# Altium schematic sheet STM32H745.SchDoc
size C; SheetNumber: 2; SheetTotal: 14
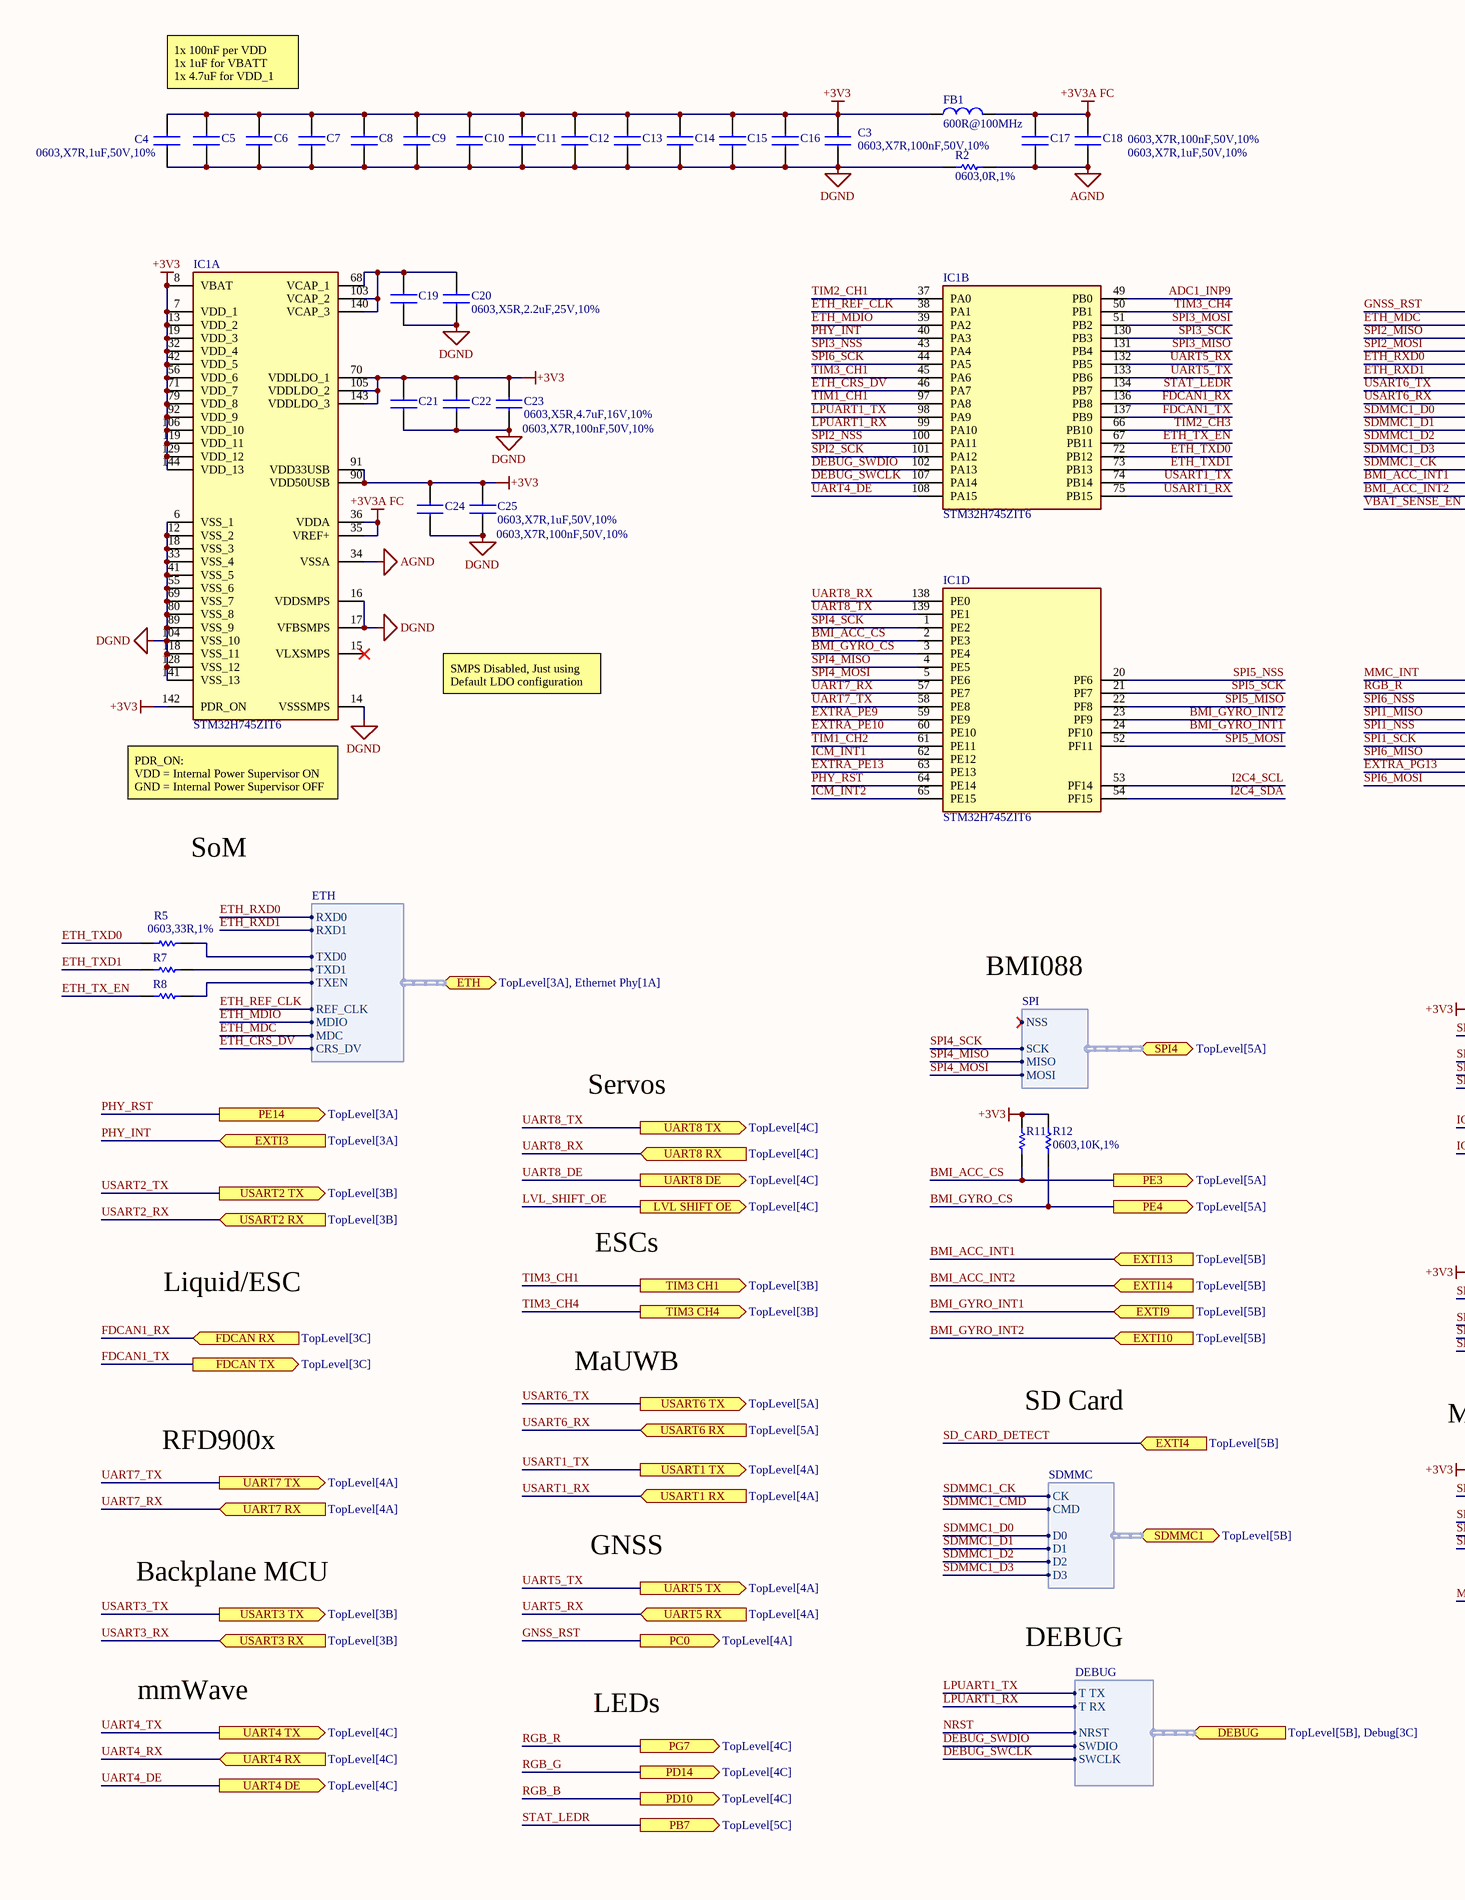
[diagram p0: STM32H745.SchDoc, left]
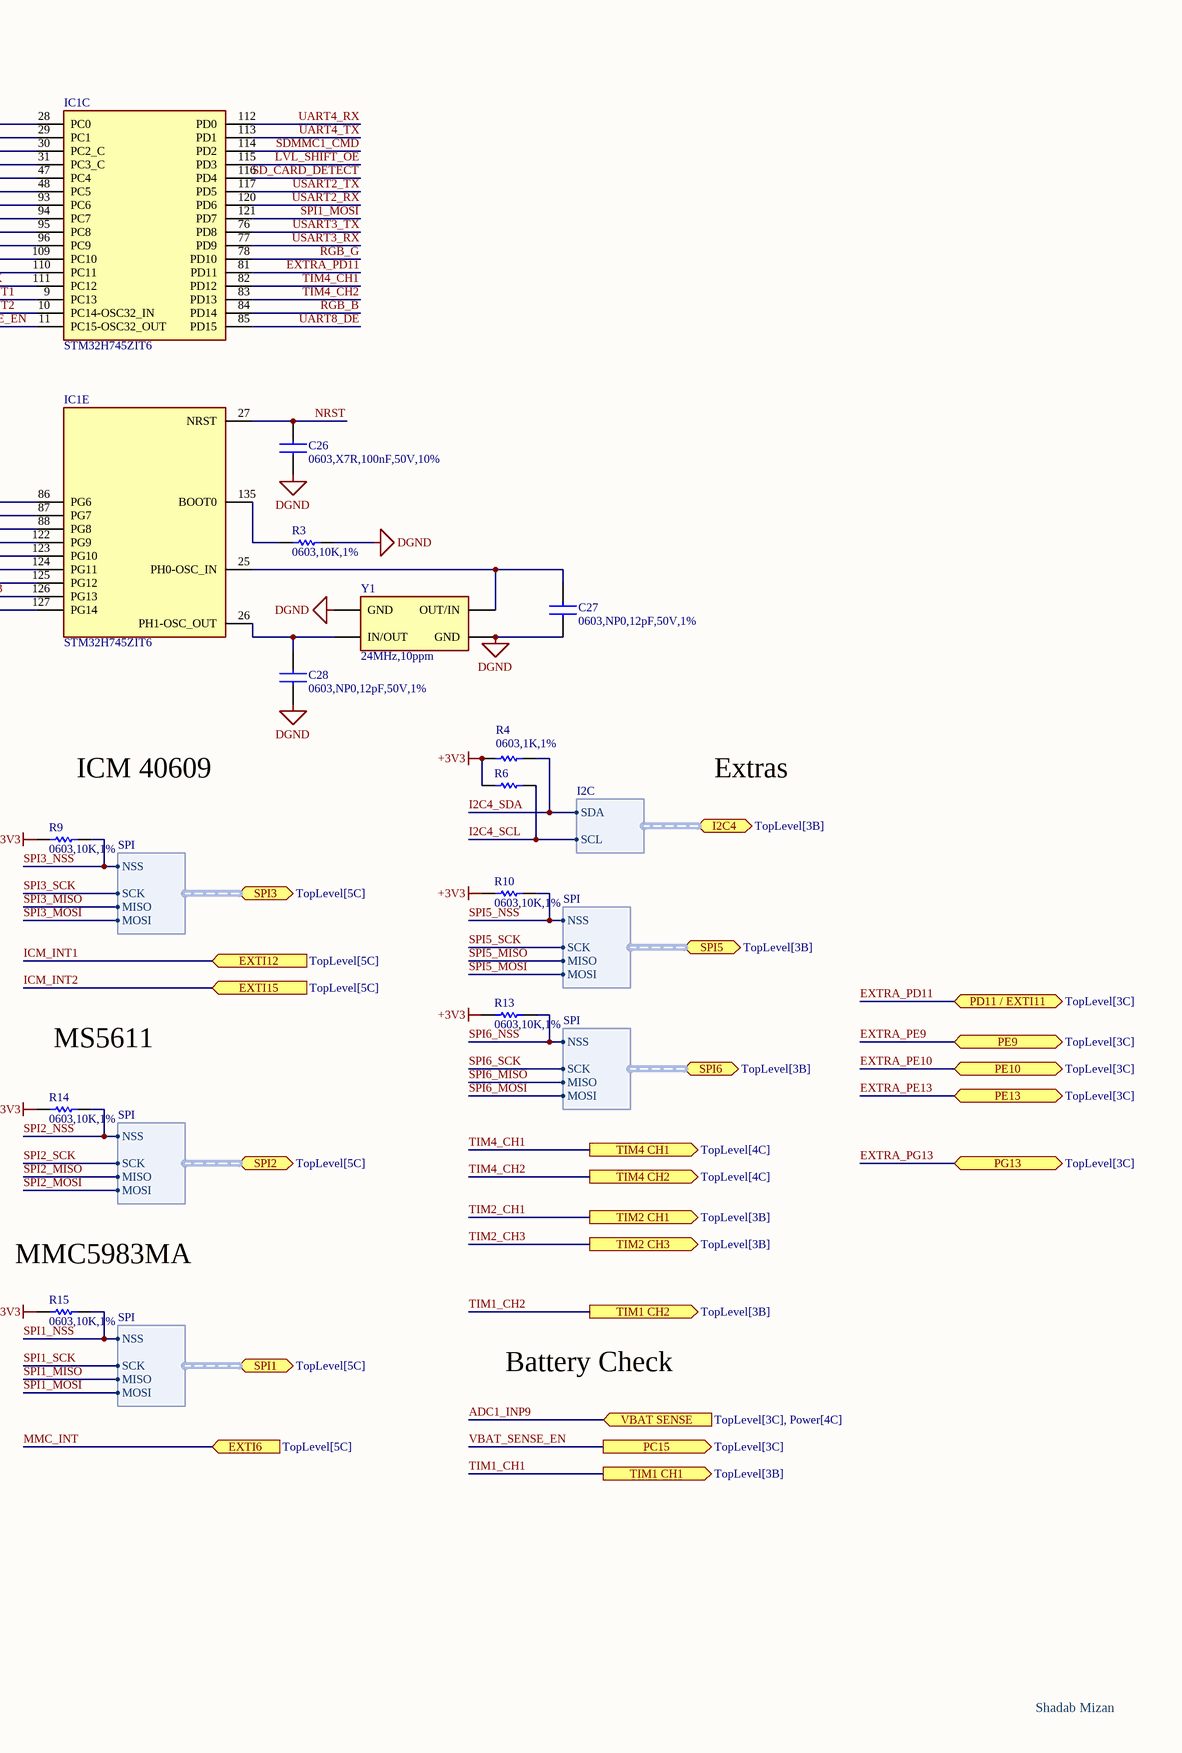
[diagram p1: STM32H745.SchDoc, right]

## Parts
C3  0603,X7R,100nF,50V,10%  [CAPC1608X90N]
C4  0603,X7R,1uF,50V,10%  [CAPC1608X90N]
C5  0603,X7R,100nF,50V,10%  [CAPC1608X90N]  (value not drawn)
C6  0603,X7R,100nF,50V,10%  [CAPC1608X90N]  (value not drawn)
C7  0603,X7R,100nF,50V,10%  [CAPC1608X90N]  (value not drawn)
C8  0603,X7R,100nF,50V,10%  [CAPC1608X90N]  (value not drawn)
C9  0603,X7R,100nF,50V,10%  [CAPC1608X90N]  (value not drawn)
C10  0603,X7R,100nF,50V,10%  [CAPC1608X90N]  (value not drawn)
C11  0603,X7R,100nF,50V,10%  [CAPC1608X90N]  (value not drawn)
C12  0603,X7R,100nF,50V,10%  [CAPC1608X90N]  (value not drawn)
C13  0603,X7R,100nF,50V,10%  [CAPC1608X90N]  (value not drawn)
C14  0603,X7R,100nF,50V,10%  [CAPC1608X90N]  (value not drawn)
C15  0603,X7R,100nF,50V,10%  [CAPC1608X90N]  (value not drawn)
C16  0603,X7R,100nF,50V,10%  [CAPC1608X90N]  (value not drawn)
C17  0603,X7R,100nF,50V,10%  [CAPC1608X90N]
C18  0603,X7R,1uF,50V,10%  [CAPC1608X90N]
C19  0603,X5R,2.2uF,25V,10%  [CAPC1608X90N]  (value not drawn)
C20  0603,X5R,2.2uF,25V,10%  [CAPC1608X90N]
C21  0603,X7R,100nF,50V,10%  [CAPC1608X90N]  (value not drawn)
C22  0603,X7R,100nF,50V,10%  [CAPC1608X90N]
C23  0603,X5R,4.7uF,16V,10%  [CAPC1608X90N]
C24  0603,X7R,100nF,50V,10%  [CAPC1608X90N]
C25  0603,X7R,1uF,50V,10%  [CAPC1608X90N]
C26  0603,X7R,100nF,50V,10%  [CAPC1608X90N]
C27  0603,NP0,12pF,50V,1%  [CAPC1608X90N]
C28  0603,NP0,12pF,50V,1%  [CAPC1608X90N]
FB1  600R@100MHz  [BLM18SP221SN1B]
IC1  STM32H745ZIT6  [QFP50P2200X2200X160-144N]  (parts A,B,C,D,E of 5)
R2  0603,0R,1%  [RESC1608X90N]
R3  0603,10K,1%  [RESC1608X90N]
R4  0603,1K,1%  [RESC1608X90N]
R5  0603,33R,1%  [RESC1608X90N]
R6  0603,1K,1%  [RESC1608X90N]  (value not drawn)
R7  0603,33R,1%  [RESC1608X90N]  (value not drawn)
R8  0603,33R,1%  [RESC1608X90N]  (value not drawn)
R9  0603,10K,1%  [RESC1608X90N]
R10  0603,10K,1%  [RESC1608X90N]
R11  0603,10K,1%  [RESC1608X90N]  (value not drawn)
R12  0603,10K,1%  [RESC1608X90N]
R13  0603,10K,1%  [RESC1608X90N]
R14  0603,10K,1%  [RESC1608X90N]
R15  0603,10K,1%  [RESC1608X90N]
Y1  24MHz,10ppm  [CRYSTAL-SMD_4P-L3.2-W2.5-BL]

## Ports
DEBUG (in, harness DEBUG, see TopLevel[5B], Debug[3C]), ETH (bidir, harness ETH, see TopLevel[3A], Ethernet Phy[1A]), EXTI3 (in, see TopLevel[3A]), EXTI4 (in, see TopLevel[5B]), EXTI6 (in, see TopLevel[5C]), EXTI9 (in, see TopLevel[5B]), EXTI10 (in, see TopLevel[5B]), EXTI12 (in, see TopLevel[5C]), EXTI13 (in, see TopLevel[5B]), EXTI14 (in, see TopLevel[5B]), EXTI15 (in, see TopLevel[5C]), FDCAN RX (in, see TopLevel[3C]), FDCAN TX (out, see TopLevel[3C]), I2C4 (bidir, harness I2C, see TopLevel[3B]), LVL SHIFT OE (out, see TopLevel[4C]), PB7 (out, see TopLevel[5C]), PC0 (out, see TopLevel[4A]), PC15 (out, see TopLevel[3C]), PD10 (out, see TopLevel[4C]), PD11 / EXTI11 (bidir, see TopLevel[3C]), PD14 (out, see TopLevel[4C]), PE3 (out, see TopLevel[5A]), PE4 (out, see TopLevel[5A]), PE9 (bidir, see TopLevel[3C]), PE10 (bidir, see TopLevel[3C]), PE13 (bidir, see TopLevel[3C]), PE14 (out, see TopLevel[3A]), PG7 (out, see TopLevel[4C]), PG13 (bidir, see TopLevel[3C]), SDMMC1 (bidir, harness SDMMC, see TopLevel[5B]), SPI1 (bidir, harness SPI, see TopLevel[5C]), SPI2 (bidir, harness SPI, see TopLevel[5C]), SPI3 (bidir, harness SPI, see TopLevel[5C]), SPI4 (bidir, harness SPI, see TopLevel[5A]), SPI5 (bidir, harness SPI, see TopLevel[3B]), SPI6 (bidir, harness SPI, see TopLevel[3B]), TIM1 CH1 (out, see TopLevel[3B]), TIM1 CH2 (out, see TopLevel[3B]), TIM2 CH1 (out, see TopLevel[3B]), TIM2 CH3 (out, see TopLevel[3B]), TIM3 CH1 (out, see TopLevel[3B]), TIM3 CH4 (out, see TopLevel[3B]), TIM4 CH1 (out, see TopLevel[4C]), TIM4 CH2 (out, see TopLevel[4C]), UART4 DE (out, see TopLevel[4C]), UART4 RX (in, see TopLevel[4C]), UART4 TX (out, see TopLevel[4C]), UART5 RX (in, see TopLevel[4A]), UART5 TX (out, see TopLevel[4A]), UART7 RX (in, see TopLevel[4A]), UART7 TX (out, see TopLevel[4A]), UART8 DE (out, see TopLevel[4C]), UART8 RX (in, see TopLevel[4C]), UART8 TX (out, see TopLevel[4C]), USART1 RX (in, see TopLevel[4A]), USART1 TX (out, see TopLevel[4A]), USART2 RX (in, see TopLevel[3B]), USART2 TX (out, see TopLevel[3B]), USART3 RX (in, see TopLevel[3B]), USART3 TX (out, see TopLevel[3B]), USART6 RX (in, see TopLevel[5A]), USART6 TX (out, see TopLevel[5A]), VBAT SENSE (in, see TopLevel[3C], Power[4C])

## Harnesses
SPI: NSS, SCK, MISO, MOSI
I2C: SDA, SCL
SDMMC: CK, CMD, D0, D1, D2, D3
ETH: RXD0, RXD1, TXD0, TXD1, REF_CLK, MDIO, MDC, CRS_DV, TXEN
DEBUG: T TX, T RX, NRST, SWDIO, SWCLK

## Nets
+3V3: C3.2 C4.2 C5.2 C6.2 C7.2 C8.2 C9.2 C10.2 C11.2 C12.2 C13.2 C14.2 C15.2 C16.2 C21.2 C22.2 C23.2 C24.2 C25.2 FB1.1 IC1.7(VDD_1) IC1.8(VBAT) IC1.13(VDD_2) IC1.19(VDD_3) IC1.32(VDD_4) IC1.42(VDD_5) IC1.56(VDD_6) IC1.70(VDDLDO_1) IC1.71(VDD_7) IC1.79(VDD_8) IC1.90(VDD50USB) IC1.91(VDD33USB) IC1.92(VDD_9) IC1.105(VDDLDO_2) IC1.106(VDD_10) IC1.119(VDD_11) IC1.129(VDD_12) IC1.142(PDR_ON) IC1.143(VDDLDO_3) IC1.144(VDD_13) R4.1 R6.1 R9.1 R10.1 R11.2 R12.2 R13.1 R14.1 R15.1
+3V3A FC: C17.2 C18.2 FB1.2 IC1.35(VREF+) IC1.36(VDDA)
AGND: C17.1 C18.1 IC1.34(VSSA) R2.2
DGND: C3.1 C4.1 C5.1 C6.1 C7.1 C8.1 C9.1 C10.1 C11.1 C12.1 C13.1 C14.1 C15.1 C16.1 C19.1 C20.1 C21.1 C22.1 C23.1 C24.1 C25.1 C26.1 C27.1 C28.1 IC1.6(VSS_1) IC1.12(VSS_2) IC1.14(VSSSMPS) IC1.16(VDDSMPS) IC1.17(VFBSMPS) IC1.18(VSS_3) IC1.33(VSS_4) IC1.41(VSS_5) IC1.55(VSS_6) IC1.69(VSS_7) IC1.80(VSS_8) IC1.89(VSS_9) IC1.104(VSS_10) IC1.118(VSS_11) IC1.128(VSS_12) IC1.141(VSS_13) R2.1 R3.2 Y1.2(GND) Y1.4(GND)
ADC1_INP9: IC1.49(PB0) ; port VBAT SENSE
BMI_ACC_CS: IC1.2(PE3) R11.1 ; port PE3
BMI_ACC_INT1: IC1.9(PC13) ; port EXTI13
BMI_ACC_INT2: IC1.10(PC14-OSC32_IN) ; port EXTI14
BMI_GYRO_CS: IC1.3(PE4) R12.1 ; port PE4
BMI_GYRO_INT1: IC1.24(PF10) ; port EXTI9
BMI_GYRO_INT2: IC1.23(PF9) ; port EXTI10
DEBUG_SWCLK: IC1.107(PA14) ; port DEBUG.SWCLK
DEBUG_SWDIO: IC1.102(PA13) ; port DEBUG.SWDIO
ETH_CRS_DV: IC1.46(PA7) ; port ETH.CRS_DV
ETH_MDC: IC1.29(PC1) ; port ETH.MDC
ETH_MDIO: IC1.39(PA2) ; port ETH.MDIO
ETH_REF_CLK: IC1.38(PA1) ; port ETH.REF_CLK
ETH_RXD0: IC1.47(PC4) ; port ETH.RXD0
ETH_RXD1: IC1.48(PC5) ; port ETH.RXD1
ETH_TX_EN: IC1.67(PB11) R8.1
ETH_TXD0: IC1.72(PB12) R5.1
ETH_TXD1: IC1.73(PB13) R7.1
EXTRA_PD11: IC1.81(PD11) ; port PD11 / EXTI11
EXTRA_PE9: IC1.59(PE9) ; port PE9
EXTRA_PE10: IC1.60(PE10) ; port PE10
EXTRA_PE13: IC1.63(PE13) ; port PE13
EXTRA_PG13: IC1.126(PG13) ; port PG13
FDCAN1_RX: IC1.136(PB8) ; port FDCAN RX
FDCAN1_TX: IC1.137(PB9) ; port FDCAN TX
GNSS_RST: IC1.28(PC0) ; port PC0
I2C4_SCL: IC1.53(PF14) R6.2 ; port I2C4.SCL
I2C4_SDA: IC1.54(PF15) R4.2 ; port I2C4.SDA
ICM_INT1: IC1.62(PE12) ; port EXTI12
ICM_INT2: IC1.65(PE15) ; port EXTI15
LPUART1_RX: IC1.99(PA10) ; port DEBUG.T RX
LPUART1_TX: IC1.98(PA9) ; port DEBUG.T TX
LVL_SHIFT_OE: IC1.115(PD3) ; port LVL SHIFT OE
MMC_INT: IC1.86(PG6) ; port EXTI6
NRST: C26.2 IC1.27(NRST) ; port DEBUG.NRST
PHY_INT: IC1.40(PA3) ; port EXTI3
PHY_RST: IC1.64(PE14) ; port PE14
RGB_B: IC1.84(PD14) ; port PD10
RGB_G: IC1.78(PD10) ; port PD14
RGB_R: IC1.87(PG7) ; port PG7
SD_CARD_DETECT: IC1.116(PD4) ; port EXTI4
SDMMC1_CK: IC1.111(PC12) ; port SDMMC1.CK
SDMMC1_CMD: IC1.114(PD2) ; port SDMMC1.CMD
SDMMC1_D0: IC1.95(PC8) ; port SDMMC1.D0
SDMMC1_D1: IC1.96(PC9) ; port SDMMC1.D1
SDMMC1_D2: IC1.109(PC10) ; port SDMMC1.D2
SDMMC1_D3: IC1.110(PC11) ; port SDMMC1.D3
SPI1_MISO: IC1.122(PG9) ; port SPI1.MISO
SPI1_MOSI: IC1.121(PD7) ; port SPI1.MOSI
SPI1_NSS: IC1.123(PG10) R15.2 ; port SPI1.NSS
SPI1_SCK: IC1.124(PG11) ; port SPI1.SCK
SPI2_MISO: IC1.30(PC2_C) ; port SPI2.MISO
SPI2_MOSI: IC1.31(PC3_C) ; port SPI2.MOSI
SPI2_NSS: IC1.100(PA11) R14.2 ; port SPI2.NSS
SPI2_SCK: IC1.101(PA12) ; port SPI2.SCK
SPI3_MISO: IC1.131(PB4) ; port SPI3.MISO
SPI3_MOSI: IC1.51(PB2) ; port SPI3.MOSI
SPI3_NSS: IC1.43(PA4) R9.2 ; port SPI3.NSS
SPI3_SCK: IC1.130(PB3) ; port SPI3.SCK
SPI4_MISO: IC1.4(PE5) ; port SPI4.MISO
SPI4_MOSI: IC1.5(PE6) ; port SPI4.MOSI
SPI4_SCK: IC1.1(PE2) ; port SPI4.SCK
SPI5_MISO: IC1.22(PF8) ; port SPI5.MISO
SPI5_MOSI: IC1.52(PF11) ; port SPI5.MOSI
SPI5_NSS: IC1.20(PF6) R10.2 ; port SPI5.NSS
SPI5_SCK: IC1.21(PF7) ; port SPI5.SCK
SPI6_MISO: IC1.125(PG12) ; port SPI6.MISO
SPI6_MOSI: IC1.127(PG14) ; port SPI6.MOSI
SPI6_NSS: IC1.88(PG8) R13.2 ; port SPI6.NSS
SPI6_SCK: IC1.44(PA5) ; port SPI6.SCK
STAT_LEDR: IC1.134(PB7) ; port PB7
TIM1_CH1: IC1.97(PA8) ; port TIM1 CH1
TIM1_CH2: IC1.61(PE11) ; port TIM1 CH2
TIM2_CH1: IC1.37(PA0) ; port TIM2 CH1
TIM2_CH3: IC1.66(PB10) ; port TIM2 CH3
TIM3_CH1: IC1.45(PA6) ; port TIM3 CH1
TIM3_CH4: IC1.50(PB1) ; port TIM3 CH4
TIM4_CH1: IC1.82(PD12) ; port TIM4 CH1
TIM4_CH2: IC1.83(PD13) ; port TIM4 CH2
UART4_DE: IC1.108(PA15) ; port UART4 DE
UART4_RX: IC1.112(PD0) ; port UART4 RX
UART4_TX: IC1.113(PD1) ; port UART4 TX
UART5_RX: IC1.132(PB5) ; port UART5 RX
UART5_TX: IC1.133(PB6) ; port UART5 TX
UART7_RX: IC1.57(PE7) ; port UART7 RX
UART7_TX: IC1.58(PE8) ; port UART7 TX
UART8_DE: IC1.85(PD15) ; port UART8 DE
UART8_RX: IC1.138(PE0) ; port UART8 RX
UART8_TX: IC1.139(PE1) ; port UART8 TX
USART1_RX: IC1.75(PB15) ; port USART1 RX
USART1_TX: IC1.74(PB14) ; port USART1 TX
USART2_RX: IC1.120(PD6) ; port USART2 RX
USART2_TX: IC1.117(PD5) ; port USART2 TX
USART3_RX: IC1.77(PD9) ; port USART3 RX
USART3_TX: IC1.76(PD8) ; port USART3 TX
USART6_RX: IC1.94(PC7) ; port USART6 RX
USART6_TX: IC1.93(PC6) ; port USART6 TX
VBAT_SENSE_EN: IC1.11(PC15-OSC32_OUT) ; port PC15
NetC19_2: C19.2 C20.2 IC1.68(VCAP_1) IC1.103(VCAP_2) IC1.140(VCAP_3)
NetC27_2: C27.2 IC1.25(PH0-OSC_IN) Y1.3(OUT/IN)
NetC28_2: C28.2 IC1.26(PH1-OSC_OUT) Y1.1(IN/OUT)
NetIC1_135: IC1.135(BOOT0) R3.1
NetR5_2: R5.2 ; port ETH.TXD0
NetR7_2: R7.2 ; port ETH.TXD1
NetR8_2: R8.2 ; port ETH.TXEN

Not connected (* = marked no-connect by the designer): IC1 15(VLXSMPS)*

## Notes on the sheet
- 1x 100nF per VDD
  1x 1uF for VBATT
  1x 4.7uF for VDD_1
- SMPS Disabled, Just using Default LDO configuration
- (near IC1) PDR_ON:
  VDD = Internal Power Supervisor ON
  GND = Internal Power Supervisor OFF
- SoM
- BMI088
- ICM 40609
- Extras
- Servos
- ESCs
- MS5611
- Liquid/ESC
- MaUWB
- RFD900x
- SD Card
- (near R15) MMC5983MA
- Battery Check
- Backplane MCU
- GNSS
- DEBUG
- mmWave
- LEDs
- Shadab Mizan

## Library data of the parts
C3 C5-C17 C21 C22 C24 C26 = CC0603KRX7R9BB104: 50V 100nF X7R ±10% 0603 Multilayer Ceramic Capacitors MLCC - SMD/SMT ROHS; LCSC Part #: C14663; Manu Part #: CC0603KRX7R9BB104
C4 C18 C25 = CL10A105KB8NNNC: 50V 1uF X7R ±10% 0603 Multilayer Ceramic Capacitors MLCC - SMD/SMT ROHS; LCSC Part #: C15849; Manu Part #: CL10A105KB8NNNC
C19 C20 = CL10A225KO8NNNC: 2.2 µF ±10% 25V Ceramic Capacitor X5R 0603 (1608 Metric); Manu Part #: CL10A225KO8NNNC; LCSC Part #: C23630
C23 = CL10A475KO8NNNC: 16V 4.7uF X5R ±10% 0603 Multilayer Ceramic Capacitors MLCC - SMD/SMT ROHS; LCSC Part #: C19666; Manu Part #: CL10A475KO8NNNC
C27 C28 = CL10C120JB8NNNC: 12pF ±1% 50V Ceramic Capacitor NP0 0603; LCSC Part #: C38523; Manu Part #: CL10C120JB8NNNC
FB1 = BLM18AG601SN1D: 380mΩ ±25% 600Ω@100MHz 0603 Ferrite Beads ROHS; LCSC Part #: C19330; Manu Part #: BLM18AG601SN1D
IC1 = STM32H745ZIT6: Dual 32-bit Arm Cortex-M7 and -M4 MCUs, up to 2MB Flash, 1MB RAM, 46 com. and analog interfaces, SMPS; Manu Part #: STM32H745ZIT6; LCSC Part #: C730193
R2 = 0603WAF0000T5E: 0Ω 100mW 75V Thick Film Resistor ±1% 0603 Chip Resistor - Surface Mount RoHS; LCSC Part #: C21189; Manu Part #: 0603WAF0000T5E
R3 R9-R15 = 0603WAF1002T5E: 100mW Thick Film Resistor 75V ±100ppm/℃ ±1% 10kΩ 0603 Chip Resistor - Surface Mount ROHS; LCSC Part #: C25804; Manu Part #: 0603WAF1002T5E
R4 R6 = 0603WAF1001T5E: 100mW 1kΩ 75V Thick Film Resistor ±100ppm/℃ ±1% 0603 Chip Resistor - Surface Mount RoHS; LCSC Part #: C21190; Manu Part #: 0603WAF1001T5E
R5 R7 R8 = 0603WAF330JT5E: 100mW 33Ω 75V Thick Film Resistor ±100ppm/℃ ±1% 0603 Chip Resistor - Surface Mount RoHS; LCSC Part #: C23140; Manu Part #: 0603WAF330JT5E
Y1 = XC32M4-24.000-F12NJDTL: Crystal 24MHz ±10ppm 12pF 50Ω SMD3225-4P; Manu Part #: XC32M4-24.000-F12NJDTL; LCSC Part #: C5122304